# EAGLE design DC-DC_v2 (EAGLE 9.5.2)
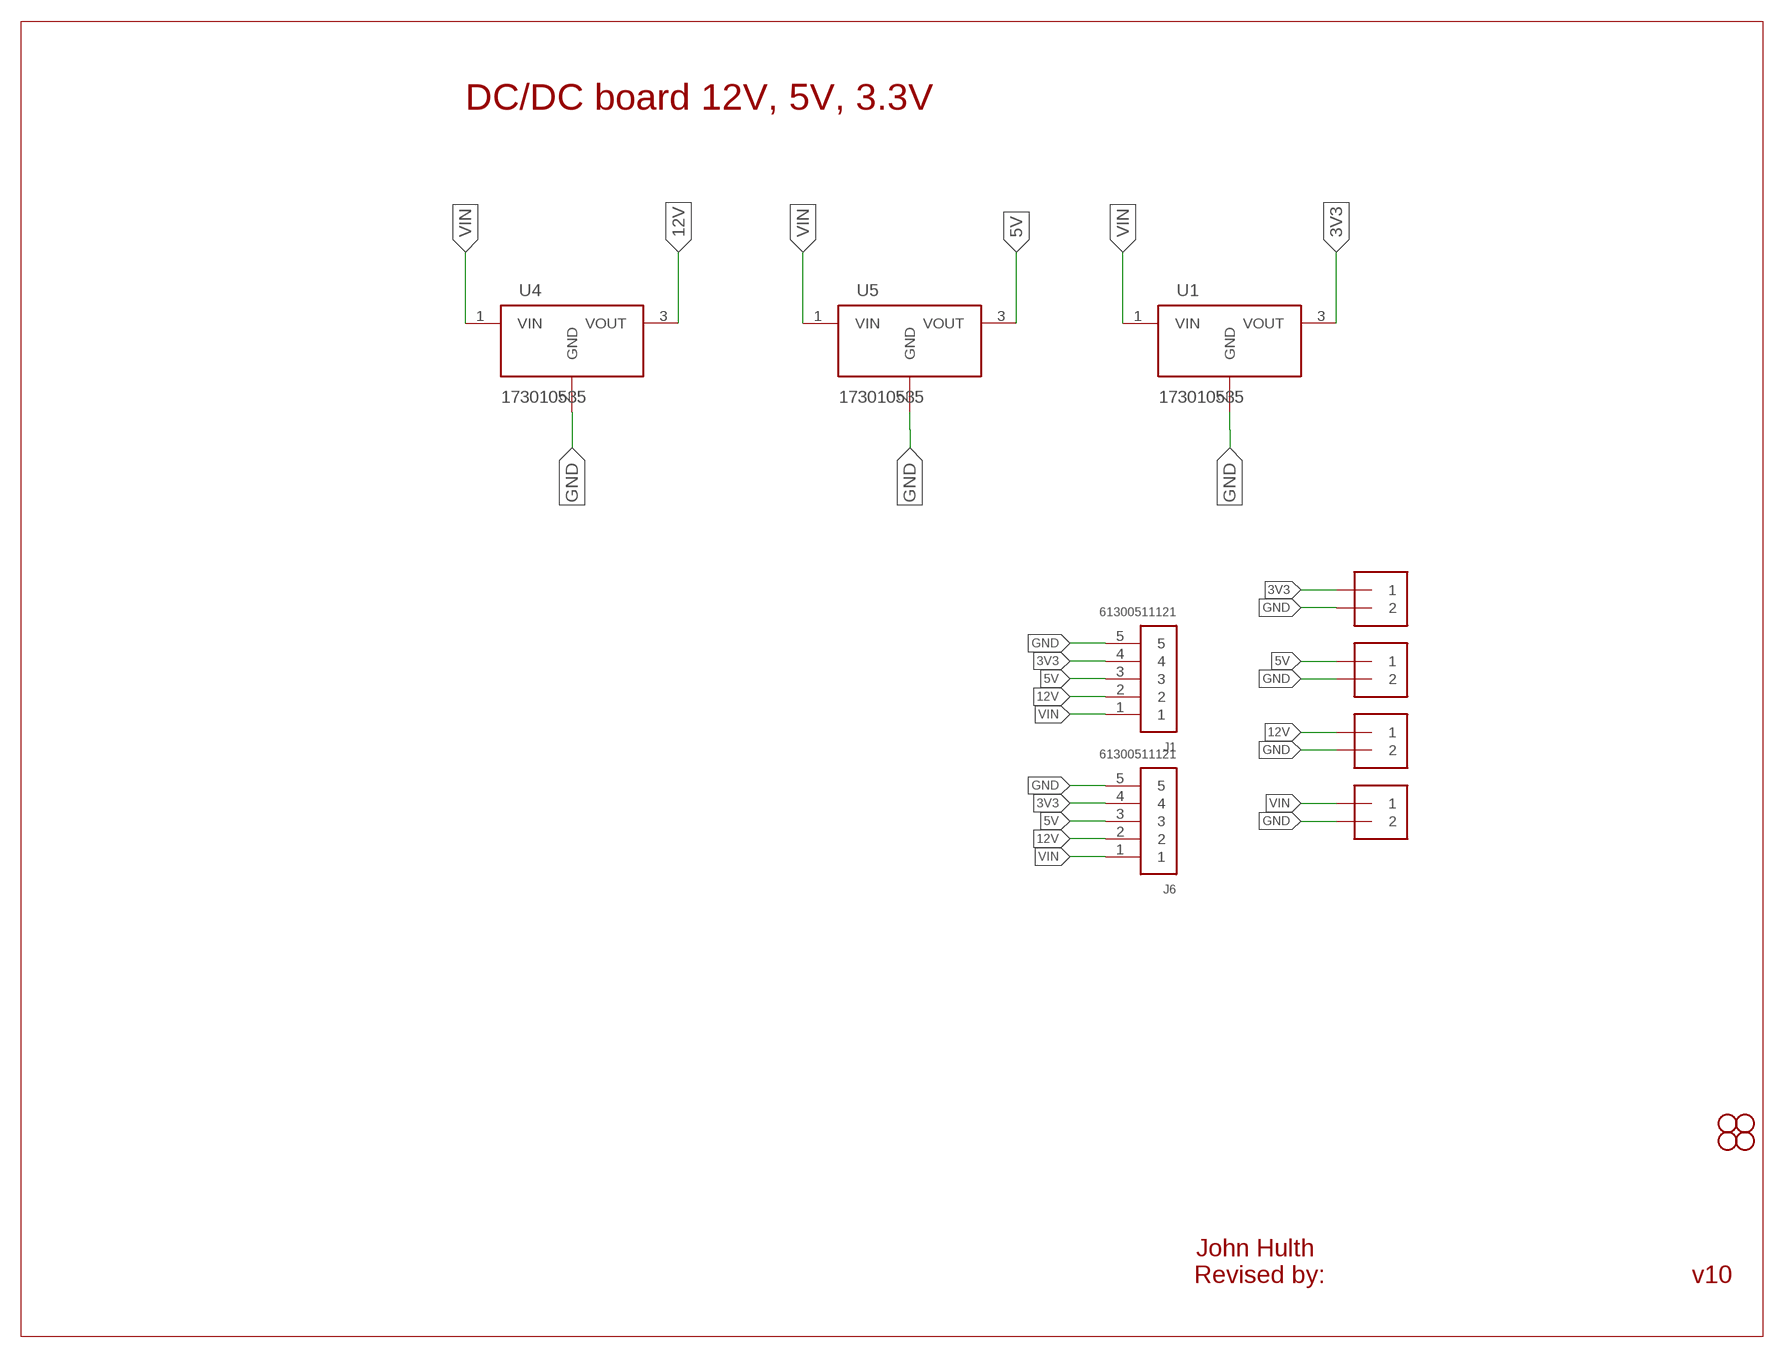
[diagram p0: schematic, sheet 1]

## Parts
J1  61300511121  [61300511121]
J2  1X2-3.5MM  [1X2-3.5MM]
J3  1X2-3.5MM  [1X2-3.5MM]
J4  1X2-3.5MM  [1X2-3.5MM]
J5  1X2-3.5MM  [1X2-3.5MM]
J6  61300511121  [61300511121]
JP2  STAND-OFF  [STAND-OFF]
JP3  STAND-OFF  [STAND-OFF]
JP8  STAND-OFF  [STAND-OFF]
JP9  STAND-OFF  [STAND-OFF]
U1  173010535  [173010535]
U4  173010535  [173010535]
U5  173010535  [173010535]

## Nets
3V3: J1.4 J2.1 J6.4 U1.3(VOUT)
5V: J1.3 J3.1 J6.3 U5.3(VOUT)
12V: J1.2 J4.1 J6.2 U4.3(VOUT)
GND: J1.5 J2.2 J3.2 J4.2 J5.2 J6.5 U1.2(GND) U4.2(GND) U5.2(GND)
VIN: J1.1 J5.1 J6.1 U1.1(VIN) U4.1(VIN) U5.1(VIN)

## Notes on the sheet
- DC/DC board 12V, 5V, 3.3V
- John Hulth
- Revised by: | v10

## Library data of the parts
J1 J6 = Headers:61300511121: CONN HEADER VERT 5POS 2.54MM Manufacturer's datasheet <https://katalog.we-online.de/em/datasheet/6130xx11121.pdf>; CREATED_BY: PCBLayout.com; DIGI_KEY_PART_NUMBER: 732-5318-ND; MANUFACTURER: Wurth Electronics Inc.; MPN: 61300511121
J2-J5 = adafruit:1X2: 3.5mm Terminal block http://www.ladyada.net/library/pcb/eaglelibrary.html
JP2 JP3 JP8 JP9 = SparkFun:STAND-OFF: Stand Off This is the mechanical footprint for a #4 phillips button head screw. Use the keepout ring to avoid running the screw head into surrounding components. SKU : PRT-00447
U1 U4 U5 = DC-DC Converter:173010535: FDSM FIXED STEP DOWN REGULATOR M Manufacturer's datasheet <https://www.we-online.com/catalog/datasheet/173010335.pdf>; CREATED_BY: PCBLayout.com; DIGIKEY_PARTNO: 732-173010535-ND; MANUFACTURER: Würth Elektronik; MPN: 173010535

## Board
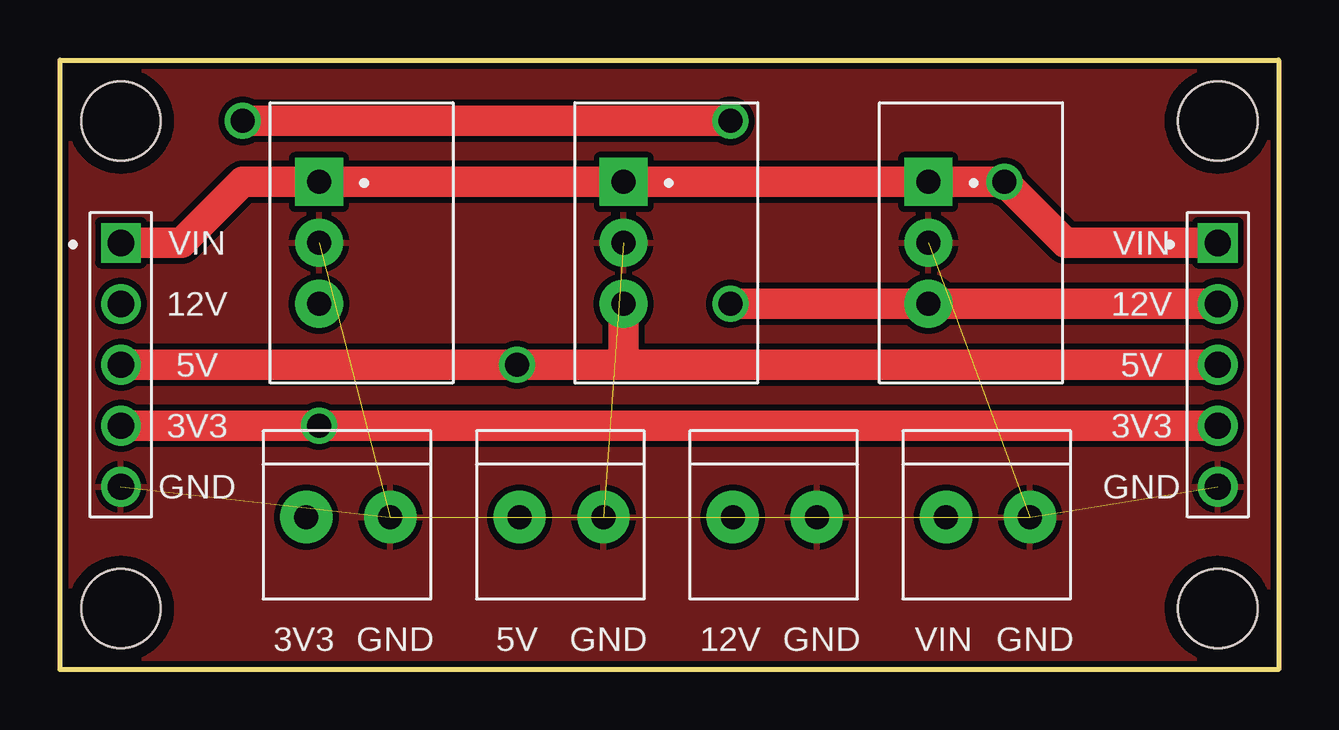
[diagram p1: board, top side]
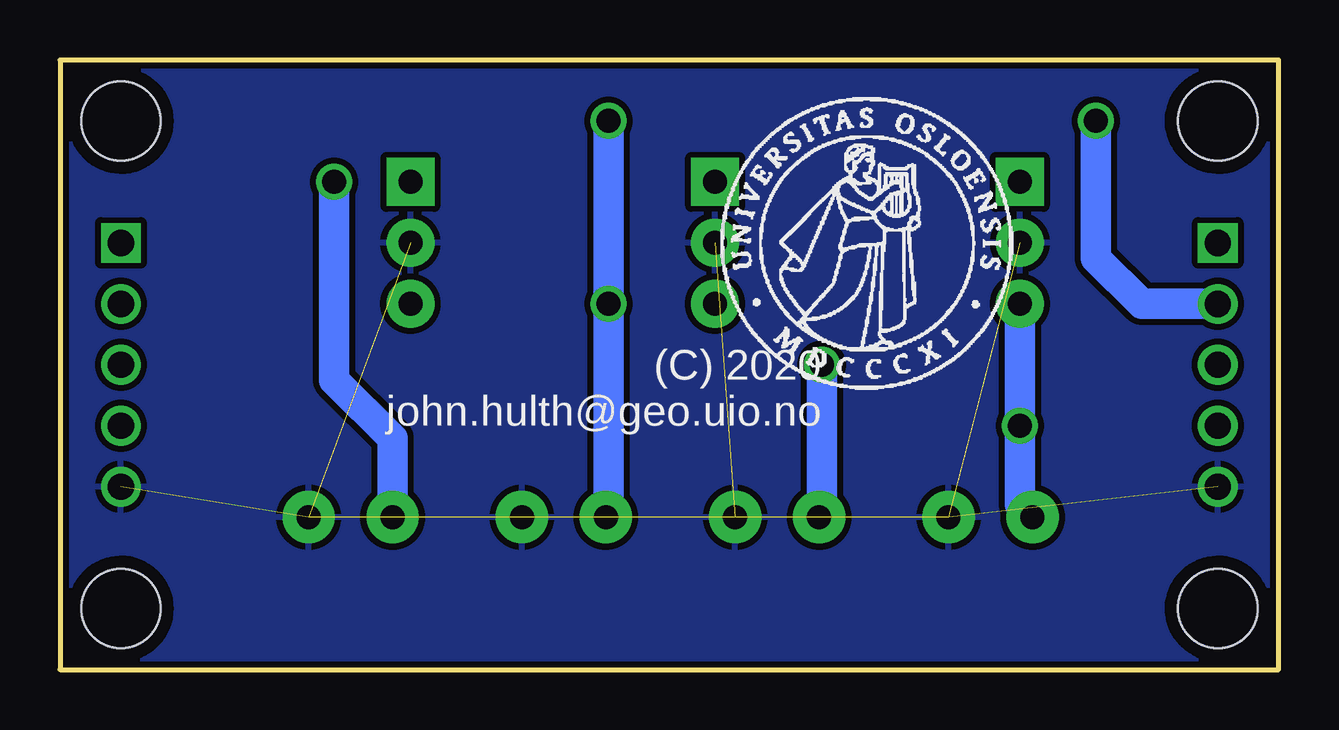
[diagram p2: board, bottom side, seen from below]

Size 50.8 x 25.4 mm. Coordinates in mm from the lower left corner, seen from the top.
Outline: 0,0 0,25.4 50.8,25.4 50.8,0 0,0
Copper layers (1*16): Top 0.035mm / dielectric 1.5mm / Bottom 0.035mm
Design rules "SparkFun-2-layer-TIGHT": minimum track width 7mil, minimum drill 15mil, track to track 7mil, track to pad 7mil, pad to pad 7mil, via to via 7mil, smd to smd 7mil, copper to edge 7mil, drill to drill 7mil, minimum pad ring 7mil, minimum via ring 7mil, stop-mask expansion 4mil, vias tented up to drill 25mil, thermal gap 10mil

### Footprints (pad centres in the part's own frame; a part is rotated, then mirrored left to right if it is on the bottom)
61300511121 = drill 1.1 square: 1 -5.08,0 | drill 1.1: 2 -2.54,0; 3 0,0; 4 2.54,0; 5 5.08,0
1X2-3.5MM = drill 1 pad 2.184: 1 1.8,0; 2 -1.7,0
STAND-OFF = hole 3.302: 0,0
173010535 = drill 1 pad 2 square: 1 -2.54,0 | drill 1 pad 2: 2 0,0; 3 2.54,0

### Placement (x,y rotation side)
J1  48.26,12.7 270 top
J2  12.06,6.35 180 top
J3  20.95,6.35 180 top
J4  29.84,6.35 180 top
J5  38.73,6.35 180 top
J6  2.54,12.7 270 top
JP2  2.54,2.54 0 top
JP3  48.26,2.54 0 top
JP8  48.26,22.86 0 top
JP9  2.54,22.86 0 top
U1  10.79,17.78 270 top
U4  36.2,17.78 270 top
U5  23.5,17.78 270 top
U$3  [UIO-LOGO-BL]  23.5,11.43 0 bottom

### Tracks (layer width: path | path; a pad name or v marks a point on that pad's centre or on a via)
3V3  (via drill 1)
  Top 1.27: J1.4 v10.79,10.16 J6.4
  Bottom 1.27: J2.1 10.79,6.88 v10.79,10.16 U1.3
5V  (via drill 1)
  Top 1.27: J1.3 23.5,12.7 | 23.5,12.7 v19.05,12.7 J6.3 | 23.5,12.7 U5.3
  Bottom 1.27: J3.1 19.05,6.46 v19.05,12.7
12V  (via drill 1)
  Top 1.27: J1.2 U4.3 v27.94,15.24 | v27.94,22.86 v7.62,22.86
  Bottom 1.27: J6.2 5.71,15.24 7.62,17.14 v7.62,22.86 | J4.1 27.94,6.46 v27.94,15.24 v27.94,22.86
GND  (8 unrouted)
  pour Top (isolate 0.254): 50.8,0 50.8,25.4 0,25.4 0,0
  pour Bottom (isolate 0.254): 50.8,0 50.8,25.4 0,25.4 0,0
VIN  (via drill 1)
  Top 1.27: J6.1 5.08,17.78 7.62,20.32 U1.1 U5.1 U4.1 v39.37,20.32 41.91,17.78 J1.1
  Bottom 1.27: J5.1 36.94,9.63 39.37,12.06 v39.37,20.32

### Text on the board
tPlace: VIN | VIN | 12V | 12V | 5V | 5V | 3V3 | 3V3 | GND | GND | 3V3 | GND | 5V | GND | 12V | GND | VIN | GND
bPlace: (C) 2020 / john.hulth@geo.uio.no